# Altium schematic sheet Power.SchDoc: Power
size A4; Author: SCA/JMO; DrawnBy: IPE; Engineer: IPE; Address1: ETML-ES; Address2: Rue de Sébeillon 12; Address3: 1004 Lausanne; Revision: 17300C; SheetNumber: 1; SheetTotal: 3; Version: C; Modifc: Voir 17300_Portier-MOD-v_B.docx
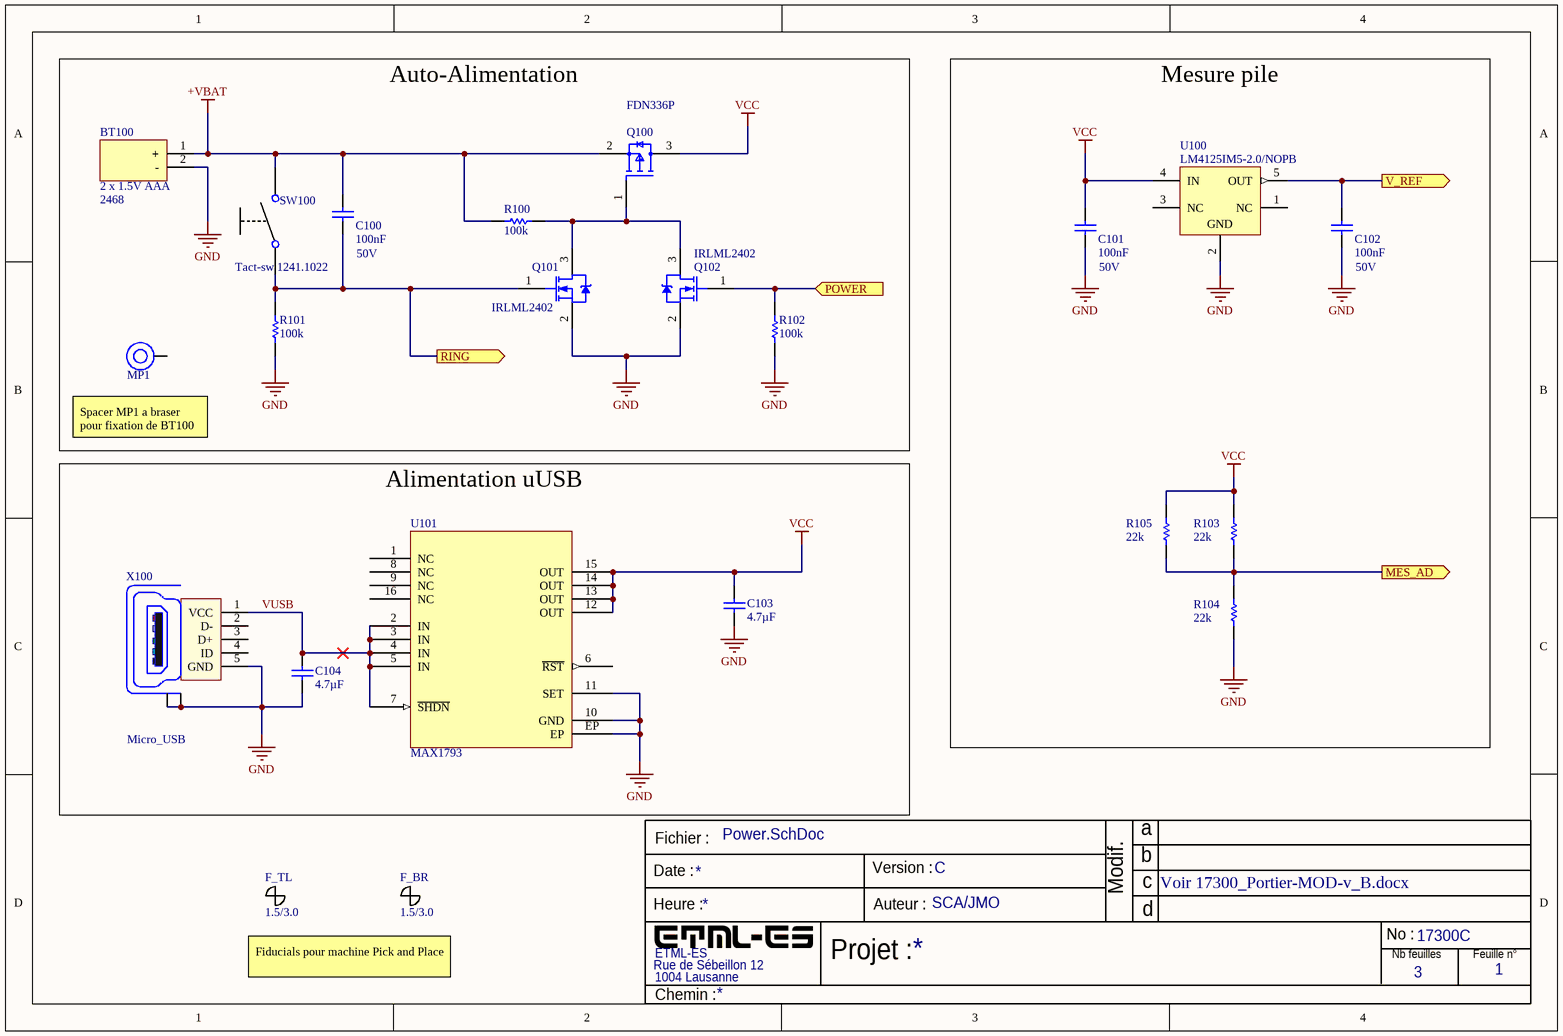
[diagram p0: Power.SchDoc]

## Parts
BT100  2 x 1.5V AAA  [2468_3D_Keystone]
C100  100nF  Rated Voltage (DC): 50V  [WCAP-CSGP_0805_L2W1.25H0.8_Reflow]
C101  100nF  Rated Voltage (DC): 50V  [WCAP-CSGP_0805_L2W1.25H0.8_Reflow]
C102  100nF  Rated Voltage (DC): 50V  [WCAP-CSGP_0805_L2W1.25H0.8_Reflow]
C103  4.7µF  [WCAP-CSGP_0805_L2W1.25H1.25]
C104  4.7µF  [WCAP-CSGP_0805_L2W1.25H1.25]
F_BR  1.5/3.0  [FID-150-300]  (no BOM)
F_TL  1.5/3.0  [FID-150-300]  (no BOM)
MP1  M3 x 3mm  [9774030360]  (value not drawn)
Q100  FDN336P  [FP-527AG-IPC_A]
Q101  IRLML2402  [INTR-IRLML2402TRPBF-3_V]
Q102  IRLML2402  [INTR-IRLML2402TRPBF-3_V]
R100  100k  [RESC2013X70X40ML20T20]
R101  100k  [RESC2013X70X40ML20T20]
R102  100k  [RESC2013X70X40ML20T20]
R103  22k  [RESC2013X50X30NL20T20]
R104  22k  [RESC2013X50X30NL20T20]
R105  22k  [RESC2013X50X30NL20T20]
SW100  Tact-sw 1241.1022  [Tact-sw 1241.1022]
U100  LM4125IM5-2.0/NOPB  [DBV0005A_M]
U101  MAX1793  [TSOP65P640X110_HS-17N]
X100  Micro_USB  [Micro_USB]

## Ports
MES_AD (out), POWER (in), RING (out), V_REF (out)

## Nets
+VBAT: BT100.1(+) C100.2 Q100.2(S) R100.2 SW100.2
GND: BT100.2(-) C101.1 C102.1 C103.1 C104.1 Q101.2(S) Q102.2(S) R101.1 R102.1 R104.1 U100.2(GND) U101.10(GND) U101.11(SET) U101.EP X100.5(GND) X100.Z1(Shield) X100.Z2(Shield)
VCC: C101.2 C103.2 Q100.3(D) R103.2 R105.2 U100.4(IN) U101.12(OUT) U101.13(OUT) U101.14(OUT) U101.15(OUT)
MES_AD: R103.1 R104.2 R105.1 ; port MES_AD
POWER: Q102.1(G) R102.2 ; port POWER
RING: C100.1 Q101.1(G) R101.2 SW100.1 ; port RING
V_REF: C102.2 U100.5(OUT) ; port V_REF
VUSB: C104.2 U101.2(IN) U101.3(IN) U101.4(IN) U101.5(IN) U101.7(~{SHDN}) X100.1(VCC)
NetQ100_1: Q100.1(G) Q101.3(D) Q102.3(D) R100.1

Not connected (* = marked no-connect by the designer): MP1 1; U100 1(NC) 3(NC); U101 1(NC) 6(~{RST}) 8(NC) 9(NC) 16(NC); X100 2(D-) 3(D+) 4(ID)

## Notes on the sheet
- Auto-Alimentation
- (near MP1) Spacer MP1 a braser pour fixation de BT100
- Mesure pile
- Alimentation uUSB
- Fiducials pour machine Pick and Place
- Fichier :
- a
- Date :
- Heure :
- Version :
- Auteur :
- Modif.
- b
- c
- d
- Projet :
- No :
- Nb feuilles
- Feuille n°
- Chemin :

## Library data of the parts
BT100 = 2468: Cylindrical Battery Contacts, Clips, Holders & Springs 2AAA PC MNT HOLDER; Manufacturer_Name: Keystone Electronics; Manufacturer_Part_Number: 2468; Mouser Part Number: 534-2468; Mouser Price/Stock: https://www.mouser.co.uk/ProductDetail/Keystone-Electronics/2468?qs=3CbvriavsLAoISGi3MywrQ%3D%3D; Arrow Part Number: 2468; Arrow Price/Stock: http://www.arrow.com/en/products/2468/keystone-electronics-corp; Mouser Testing Part Number: *; Mouser Testing Price/Stock: *; Datasheet Link: https://datasheet.datasheetarchive.com/originals/distributors/Datasheets-AE/DSA3AE00005.pdf; Value: 2 x 1.5V AAA
C100-C102 = 885012207098: WCAP-CSGP Multilayer Ceramic Chip Capacitor, General Purpose, size 0805, X7R, 100nF, 50VDC; Manufacturer: Wurth Elektronik; Capacitance Tolerance: +/-10%; Case/Size Code: 0805; Dissipation Factor: 2.5%; Insulation Resistance: 5GΩ; Technical Reference: X7R0805104K050DFCT10000; Length: 2mm; ComponentLink1Description: Website Link; Width: 1.25mm; Capacitance: 100nF; ComponentLink1URL: https://www.we-online.com/redexpert/article/885012207098?ad; Mount: Surface Mount; ComponentLink2URL: https://www.we-online.com/redexpert/spec/885012207098?ad; ComponentLink2Description: Datasheet Link; Packaging: Tape and Reel; Height: 0.8mm; Category: Multilayer Ceramic Chip Capacitors; Ceramic Type: X7R; Manufacturer Part Number: 885012207098; Match Code: WCAP-CSGP; Operating Temperature Max: 125°C; Operating Temperature Min: -55°C
C103 C104 = 885012207053: WCAP-CSGP Multilayer Ceramic Chip Capacitor, General Purpose, size 0805, X7R, 4.7µF, 16VDC; PartNumber: GRM21BR61C475KA88L; Manufacturer: Wurth Elektronik; Tolerance: 10%; Voltage Rating (DC): 16 V; Capacitance Tolerance: +/-10%; Case/Size Code: 0805; Insulation Resistance: 0.02GΩ; Rated Voltage (DC): 16V; Technical Reference: X7R0805475K016DFCT10000; Value: 4.7µF 16V; DatasheetVersion: 03/2016; Width: 1.25mm; Capacitance: 4.7µF; Mount: Surface Mount; ComponentLink1Description: Website Link; Case Code (Metric): 2012; PackageDescription: 2-Pin Surface Mount Device, Body 2 x 1.25 mm; Height: 1.25mm; Voltage Rating: 16 V; Max Operating Temperature: 85 degC; Length: 2mm; ComponentLink1URL: https://www.we-online.com/redexpert/article/885012207053?ad; Mounting Technology: Surface Mount; Packaging: Tape and Reel; Min Operating Temperature: -55 degC; ComponentLink2Description: Datasheet Link; Case Code (Imperial): 0805; PackageReference: 0805; ComponentLink2URL: https://www.we-online.com/redexpert/spec/885012207053?ad; Category: Multilayer Ceramic Chip Capacitors; Ceramic Type: X7R; Dissipation Factor: 10%; Manufacturer Part Number: 885012207053; Match Code: WCAP-CSGP; Operating Temperature Max: 125°C; Operating Temperature Min: -55°C
F_BR F_TL = CMP-063-000021-1: FID 1.5/3.0; IsStocked: False; PN: PN-509779; SubCategory: Fiducials; Value: 1.5/3.0; Category: Others
MP1 = 9774030360: WA-SMSI SMT Steel Spacer with internal Thread, OD 6mm, M3 x 3mm; Manufacturer: Wurth Elektronik; Inside Diameter: 4.2mm; Surface: Tin; ComponentLink1Description: Website Link; ComponentLink1URL: https://www.we-online.com/redexpert/article/9774030360?ad; ComponentLink2Description: Datasheet Link; ComponentLink2URL: https://www.we-online.com/redexpert/spec/9774030360?ad; Manufacturer Part Number: 9774030360; Category: SMT Spacers; Match Code: WA-SMSI; Mount: Surface Mount; Operating Temperature Max: 150°C; Operating Temperature Min: -55°C; Packaging: Bulk; Height: 3mm; Material: Steel; Outside Diameter: 6mm; Thread Size: M3; Value: 9774030360
Q100 = CMP-07173-000103-1: MOSFET P-CH 20V 1.3A SSOT3; Voltage Rating (DC): -20V; Element Configuration: Single; Threshold Voltage: -900mV; Current Rating: -1.3A; Rds On Max: 200mR; Turn-Off Delay Time: 16ns; Input Capacitance: 330pF; Max Power Dissipation: 500mW; Rise Time: 12ns; Turn-On Delay Time: 7ns; Number of Elements: 1; Gate to Source Voltage (Vgs): 8V; Width: 1.4mm; Lead Free: Lead Free; Length: 2.92mm; Max Operating Temperature: 150°C; Mount: Surface Mount; Contact Plating: Tin; Radiation Hardening: No; Case/Package: TO-236-3; Weight: 0.03g; Drain to Source Breakdown Voltage: -20V; Continuous Drain Current (ID): 1.3A; Min Operating Temperature: -55°C; On-State Resistance: 200mR; Drain to Source Voltage (Vdss): 20V; Fall Time: 12ns; Drain to Source Resistance: 200mR; Package Quantity: 1; Power Dissipation: 500mW; Nominal Vgs: -900mV; Termination: SMD/SMT; Packaging: Tape and Reel; Number of Pins: 3; Dual Supply Voltage: -20V; REACH SVHC: No SVHC; Height: 0.94mm; Value: FDN336P
Q101 Q102 = CMP-2000-05155-1: HEXFET(R) Power MOSFET, N-Channel, 20 V, 1.2 A, 3-Pin SOT-23, RoHS, Tape and Reel; Manufacturer: Infineon Technologies; PartNumber: IRLML2402TRBF; Value: IRLML2402TRBF; PackageCase: SOT-23; Supplier: Digi-key,Stock ES; Supplier PN: IRLML2402PBFCT-ND; Supplier min. qty: 1; Supplier unit price: 0.34
R100-R102 = CMP-2001-04377-1: 100 kOhms ±1% 0.125W, 1/8W Chip Resistor 0805 (2012 Metric) Automotive AEC-Q200 Thick Film; Part Number: ERJ-6ENF1003V; Manufacturer: Panasonic; Value: 100k
R103-R105 = CMP-2001-03688-1: Manufacturer: Vishay Dale; Part Number: CRCW080522K0FKEA; Value: 22k
U100 = CMP-0074-00337-3: Precision Micropower Low Dropout Voltage Reference, 5-pin SOT-23, Pb-Free; Manufacturer: Texas Instruments; CompType: Voltage Reference IC; PowerWise: Y; PackageTopMarking: R80B*XTT; PackageVersion: revD, Aug-2008; DatasheetVersion: Nov-2003; RoHS: Y; ComponentLink1URL: http://www.ti.com/general/docs/lit/getliterature.tsp?genericPartNumber=LM4125&fileType=pdf; PackageReference: DBV0005A; PinCount: 5; PackageDescription: Molded SOT-23, .115 x .063 x .040 in Body, 5 Lead, .0375 in Pitch; ComponentLink1Description: Datasheet; RevisionNote: Component URLs added; Value: LM4125IM5-2.0
U101 = MAX1793: IC REG LINEAR POS ADJ 1A 16TSSOP; Manufacturer: Maxim Integrated; Value: MAX1793EUE33; Supplier: Stock ES
X100 = WR-Communication Connectors 629105150521: WR-COM_USB_Micro Type B_Horizontal_SMT; Manufacturer: Würth Elektronik eiSos GmbH; Voltage Rating: 5V; PartNumber: 629105150521; Supplier: Digi-key; Supplier PN: 732-5960-1-ND; Supplier min. qty: 1; Supplier unit price: 2.03; Supplier 1: Digi-Key; Supplier Part Number 1: 732-5960-1-ND